# Altium schematic sheet 串口板第二版.SchDoc
size A4
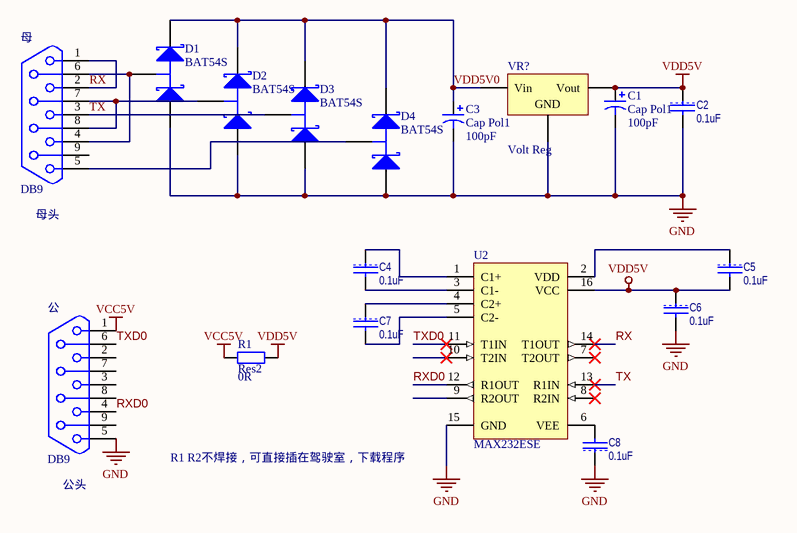
[diagram p0: 串口板第二版.SchDoc]

## Parts
C1  Cap Pol1  value 100pF  [3528]
C2  0.1uF  [0603R]
C3  Cap Pol1  value 100pF  [3528]
C4  0.1uF  [0603R]
C5  0.1uF  [0603R]
C6  0.1uF  [0603R]
C7  0.1uF  [0603R]
C8  0.1uF  [0603R]
D1  BAT54S  [SOT23_N]
D2  BAT54S  [SOT23_N]
D3  BAT54S  [SOT23_N]
D4  BAT54S  [SOT23_N]
R1  Res2  value 0R  [1608[0603]]
U2  MAX232ESE  [SOIC16_N]
VR?  Volt Reg  [SOT89N]
母  DB9  [DB9BSM]
公  DB9  [DB9BSM]

## Nets
GND: C1.2 C2.2 C3.2 C6.2 C8.1 D1.1(A) D2.1(A) D3.1(A) D4.1(A) U2.15(GND) VR?.2(GND) 公.5
VCC5V: R1.1 公.1
VDD5V: C1.1 C2.1 C5.2 C6.1 R1.2 U2.16(VCC) VR?.3(Vout)
RX: U2.14(T1OUT) 母.1 母.2
RXD0: U2.12(R1OUT) 公.4
TX: D3.3(C) U2.13(R1IN) 母.3
TXD0: U2.11(T1IN) 公.6
VDD5V0: C3.1 D1.2(K) D2.2(K) D3.2(K) D4.2(K) VR?.1(Vin)
NetC4_1: C4.1 U2.1(C1+)
NetC4_2: C4.2 U2.3(C1-)
NetC5_1: C5.1 U2.2(VDD)
NetC7_1: C7.1 U2.4(C2+)
NetC7_2: C7.2 U2.5(C2-)
NetC8_2: C8.2 U2.6(VEE)
NetD1_3: D1.3(C) 母.4 母.6
NetD2_3: D2.3(C) 母.7 母.8
NetD4_3: D4.3(C) 母.5

Not connected (* = marked no-connect by the designer): U2 7(T2OUT)* 8(R2IN)* 9(R2OUT) 10(T2IN)*; 母 9; 公 2 3 7 8 9

## Notes on the sheet
- (near 母) 母头
- (near 公) 公头
- R1 R2不焊接，可直接插在驾驶室，下载程序

## Library data of the parts
C1 C3 = Cap Pol1: Polarized Capacitor (Radial); Published: 8-Jun-2000; LatestRevisionDate: 17-Jul-2002; LatestRevisionNote: Re-released for DXP Platform.; PackageReference: RB7.6-15; Publisher: Altium Limited; PackageDescription: Polarized Capacitor (Radial); 2 Leads
C2 C4-C8 = CAP: Capacitor
D1-D4 = BAT54S: Schottky Barrier Double Diode; Published: 17-Sep-2003; LatestRevisionDate: 12-Dec-2006; LatestRevisionNote: IPC-7351 Footprint Added.; DatasheetVersion: 4-Mar-2002; PackageVersion: May-1999; PackageReference: SOT23; Publisher: Altium Limited; PackageDescription: 3-Pin SOT-23 Package 0.95 mm Pitch, 2.3 mm Lead Span; ComponentLink1Description: Manufacturer Link; ComponentLink1URL: http://www.semiconductors.philips.com/; ComponentLink2Description: Datasheet; ComponentLink2URL: http://www.semiconductors.philips.com/acrobat/datasheets/BAT54_SERIES_4.pdf
R1 = Res2: Resistor; Published: 8-Jun-2000; LatestRevisionDate: 17-Jul-2002; LatestRevisionNote: Re-released for DXP Platform.; PackageReference: AXIAL-0.4; Publisher: Altium Limited; PackageDescription: Axial Device, Thru-Hole; 2 Leads; 0.4 in Pin Spacing
U2 = MAX232ESE: +5V Powered, Multi-Channel RS-232 Driver/Receiver; Published: 16-Jan-2001; LatestRevisionDate: 13-Apr-2006; LatestRevisionNote: IPC-7351 Footprint Added.; PackageReference: NSO16; Publisher: Altium Limited; PackageDescription: 16-Pin Small Outline Integrated Circuit 1.27 mm Pitch; Code_JEDEC: MS-012-AC; Code_IPC: SOIC127P600-16; ComponentLink1Description: Manufacturer Link; ComponentLink1URL: http://www.maxim-ic.com/; ComponentLink2Description: Datasheet; ComponentLink2URL: http://pdfserv.maxim-ic.com/en/ds/MAX220-MAX249.pdf; Supplier 1: Digi-Key; Supplier Part Number 1: MAX232ESE+T-ND
VR? = Volt Reg: Voltage Regulator; Published: 24-Mar-1999; LatestRevisionDate: 29-May-2009; LatestRevisionNote: IPC-7351 Footprint Added.; PackageReference: D2PAK; Publisher: Altium Limited; PackageDescription: 3-Pin Transistor Outline Package 2.54 mm Pitch, 15.1 mm Lead Span